# EAGLE design breakoutWithPH (EAGLE 6.5.0)
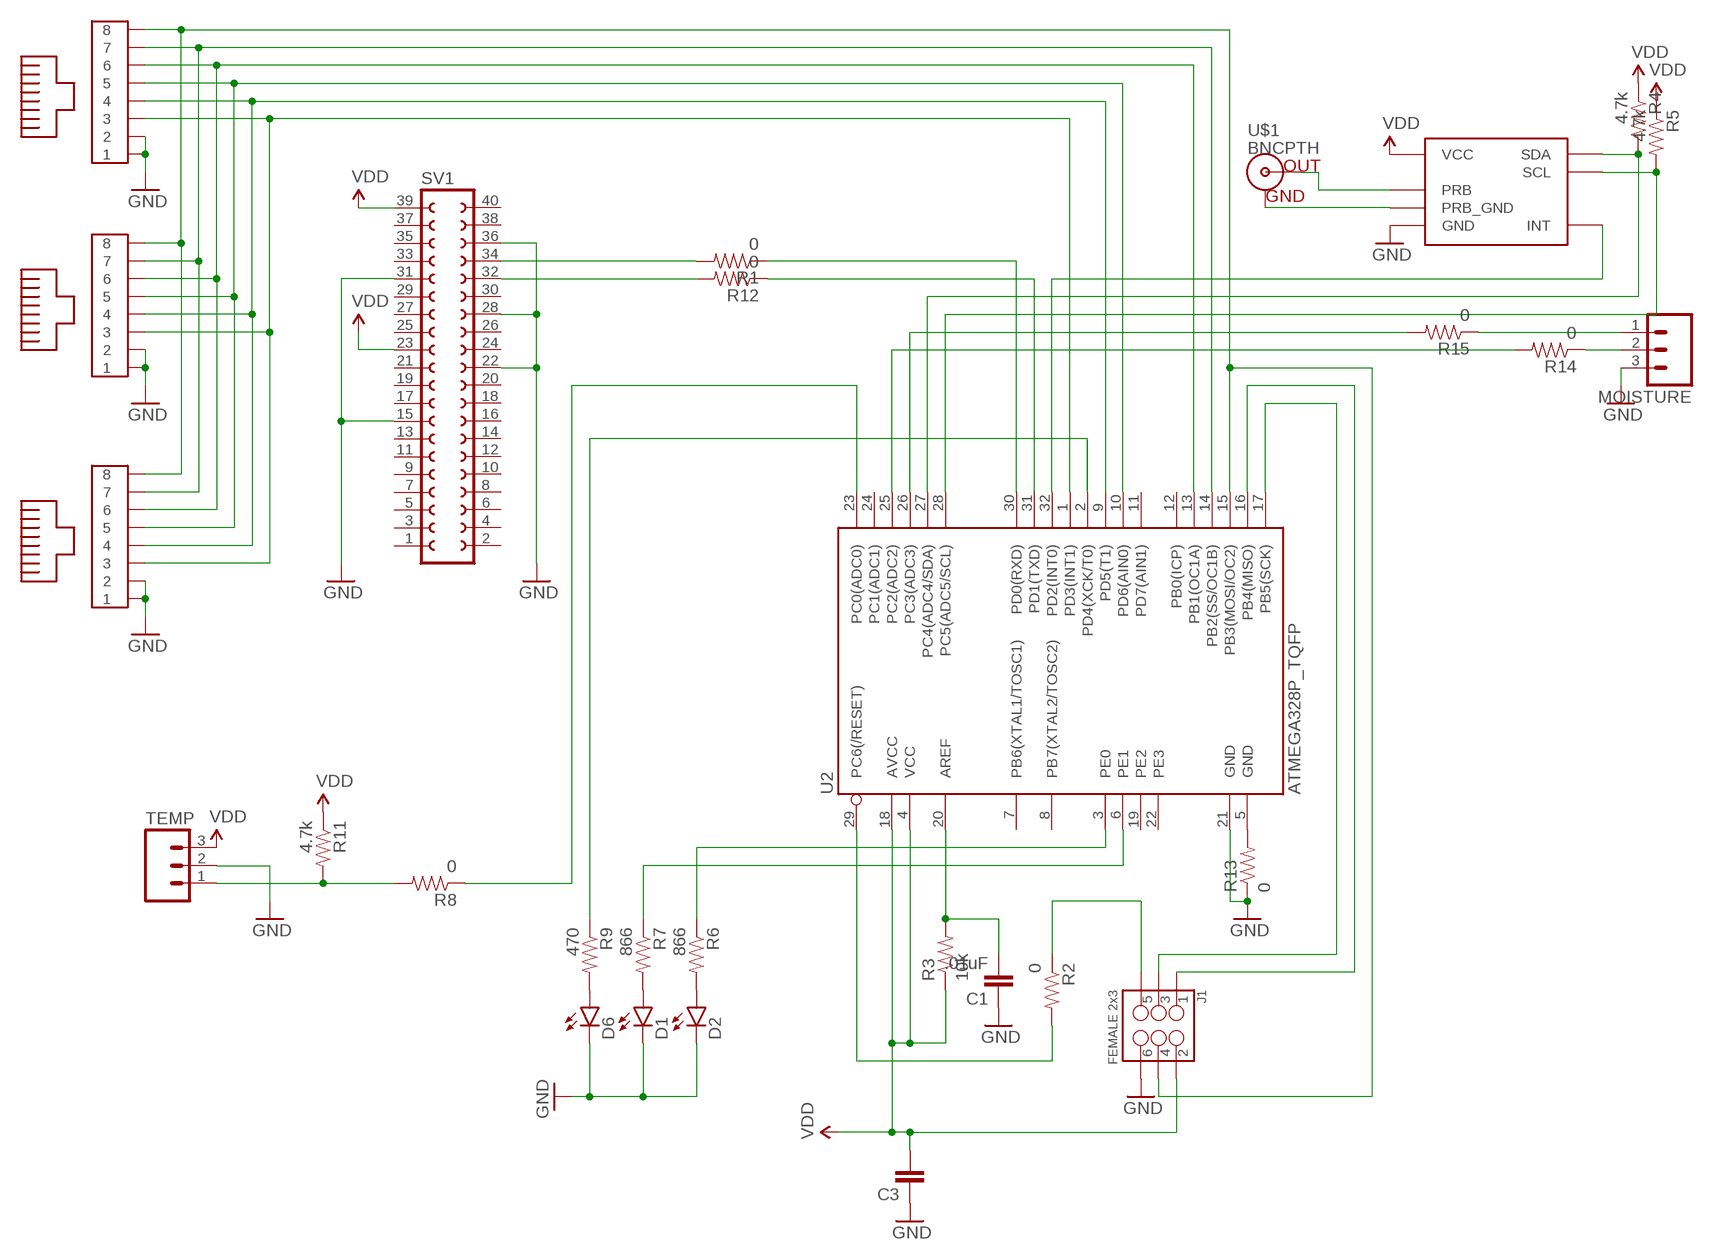
[diagram p0: schematic, sheet 1]

## Parts
C1  .01uF  CAP1206  [1206]
C3  CAP1206  [1206]
D1  LED0603  [LED-0603]
D2  LED0603  [LED-0603]
D6  LED0603  [LED-0603]
J1  FEMALE 2x3  M03X2FEMALE  [2X3]
MOISTURE  M03LOCK_LONGPADS  [1X03_LOCK_LONGPADS]
R1  0  RESISTOR1206  [1206]
R2  0  RESISTOR1206  [1206]
R3  10k  RESISTOR1206  [1206]
R4  4.7k  RESISTOR1206  [1206]
R5  4.7k  RESISTOR1206  [1206]
R6  866  RESISTOR1206  [1206]
R7  866  RESISTOR1206  [1206]
R8  0  RESISTOR1206  [1206]
R9  470  RESISTOR1206  [1206]
R11  4.7k  RESISTOR1206  [1206]
R12  0  RESISTOR1206  [1206]
R13  0  RESISTOR1206  [1206]
R14  0  RESISTOR1206  [1206]
R15  0  RESISTOR1206  [1206]
SV1  FE20-2  [FE20-2]
TEMP  M03LOCK_LONGPADS  [1X03_LOCK_LONGPADS]
U1  PH_SMD  [PH_SMD]
U2  ATMEGA328P_TQFP  [TQFP32-08]
U$1  BNCPTH  [BNC]
U$2  MOLEX-RJ45-SMT  [MOLEX-RJ45-SMT]
U$3  MOLEX-RJ45-SMT  [MOLEX-RJ45-SMT]
U$4  MOLEX-RJ45-SMT  [MOLEX-RJ45-SMT]

## Nets
GND: C1.1 C3.1 D1.C D2.C D6.C J1.6 MOISTURE.3 R13.1 SV1.15 SV1.22 SV1.28 SV1.31 SV1.36 TEMP.2 U1.6(GND) U2.21(GND) U$2.1 U$2.2 U$3.1 U$3.2 U$4.1 U$4.2
N$1: R12.1 U2.31(PD1(TXD))
N$2: J1.5 R2.1
N$3: U2.9(PD5(T1)) U$2.4 U$3.4 U$4.4
N$4: U2.1(PD3(INT1)) U$2.3 U$3.3 U$4.3
N$5: J1.4 U2.15(PB3(MOSI/OC2)) U$2.8 U$3.8 U$4.8
N$6: U2.10(PD6(AIN0)) U$2.5 U$3.5 U$4.5
N$7: D2.A R6.2
N$8: R2.2 U2.29(PC6(/RESET))
N$9: R9.1 U2.2(PD4(XCK/T0))
N$10: R1.1 U2.30(PD0(RXD))
N$11: J1.3 U2.17(PB5(SCK))
N$12: U2.13(PB1(OC1A)) U$2.6 U$3.6 U$4.6
N$13: U2.14(PB2(SS/OC1B)) U$2.7 U$3.7 U$4.7
N$14: J1.1 U2.16(PB4(MISO))
N$15: R6.1 U2.3(PE0)
N$16: U1.7(INT) U2.32(PD2(INT0))
N$17: R7.1 U2.6(PE1)
N$18: D1.A R7.2
N$19: R1.2 SV1.34
N$20: D6.A R9.2
N$21: C1.2 R3.2 U2.20(AREF)
N$23: R8.1 U2.23(PC0(ADC0))
N$24: R8.2 R11.2 TEMP.1
N$25: R5.2 U1.8(SCL) U2.28(PC5(ADC5/SCL))
N$26: R4.2 U1.1(SDA) U2.27(PC4(ADC4/SDA))
N$27: R12.2 SV1.32
N$28: R13.2 U2.5(GND)
N$29: U1.4(PRB) U$1.S(OUT)
N$30: R15.2 U2.26(PC3(ADC3))
N$31: R14.2 U2.25(PC2(ADC2))
N$32: MOISTURE.2 R14.1
N$33: MOISTURE.1 R15.1
PRB_GND: U1.5(PRB_GND) U$1.GND
VDD: C3.2 J1.2 R3.1 R4.1 R5.1 R11.1 SV1.23 SV1.39 TEMP.3 U1.3(VCC) U2.4(VCC) U2.18(AVCC)
Unconnected: SV1.1 SV1.2 SV1.3 SV1.4 SV1.5 SV1.6 SV1.7 SV1.8 SV1.9 SV1.10 SV1.11 SV1.12 SV1.13 SV1.14 SV1.16 SV1.17 SV1.18 SV1.19 SV1.20 SV1.21 SV1.24 SV1.25 SV1.26 SV1.27 SV1.29 SV1.30 SV1.33 SV1.35 SV1.37 SV1.38 SV1.40 U2.7(PB6(XTAL1/TOSC1)) U2.8(PB7(XTAL2/TOSC2)) U2.11(PD7(AIN1)) U2.12(PB0(ICP)) U2.19(PE2) U2.22(PE3) U2.24(PC1(ADC1))

## Library data of the parts
C1 C3 = SparkFun-Capacitors:CAP: Capacitor Standard 0603 ceramic capacitor, and 0.1" leaded capacitor.
D1 D2 D6 = SparkFun-LED:LED: LEDs Standard schematic elements and footprints for 5mm, 3mm, 1206, and 0603 sized LEDs. 5mm - Spark Fun Electronics SKU : COM-00529 (and others)
J1 = SparkFun-Connectors:M03X2: 2x3 .1" header. Shrouded, with keying- CONN-10681 SMT- CONN-11415 Pogo pins- HW-11044; PROD_ID: CONN-11566
MOISTURE TEMP = SparkFun-Connectors:M03: Header 3 Standard 3-pin 0.1" header. Use with straight break away headers (SKU : PRT-00116), right angle break away headers (PRT-00553), swiss pins (PRT-00743), machine pins (PRT-00117), and female headers (PRT-00115). Molex polarized connector foot print use with SKU : PRT-08232 with associated crimp pins and housings.
R1-R9 R11-R15 = SparkFun-Resistors:RESISTOR: Resistor Basic schematic elements and footprints for 0603, 1206, and PTH resistors.
SV1 = con-lsta:FE20-2: FEMALE HEADER; OC_FARNELL: unknown; OC_NEWARK: unknown
U1 = custom-mlane:PH_SMD
U2 = custom-mlane:ATMEGA328P_TQFP; PROD_ID: IC-09069; VALUE: ATMEGA328PB_TQFP
U$1 = SparkFun-Connectors:BNC: BNC Connector, Mouser Part# 5227161
U$2-U$4 = SMD-RJ45:MOLEX-RJ45-SMT

## Board
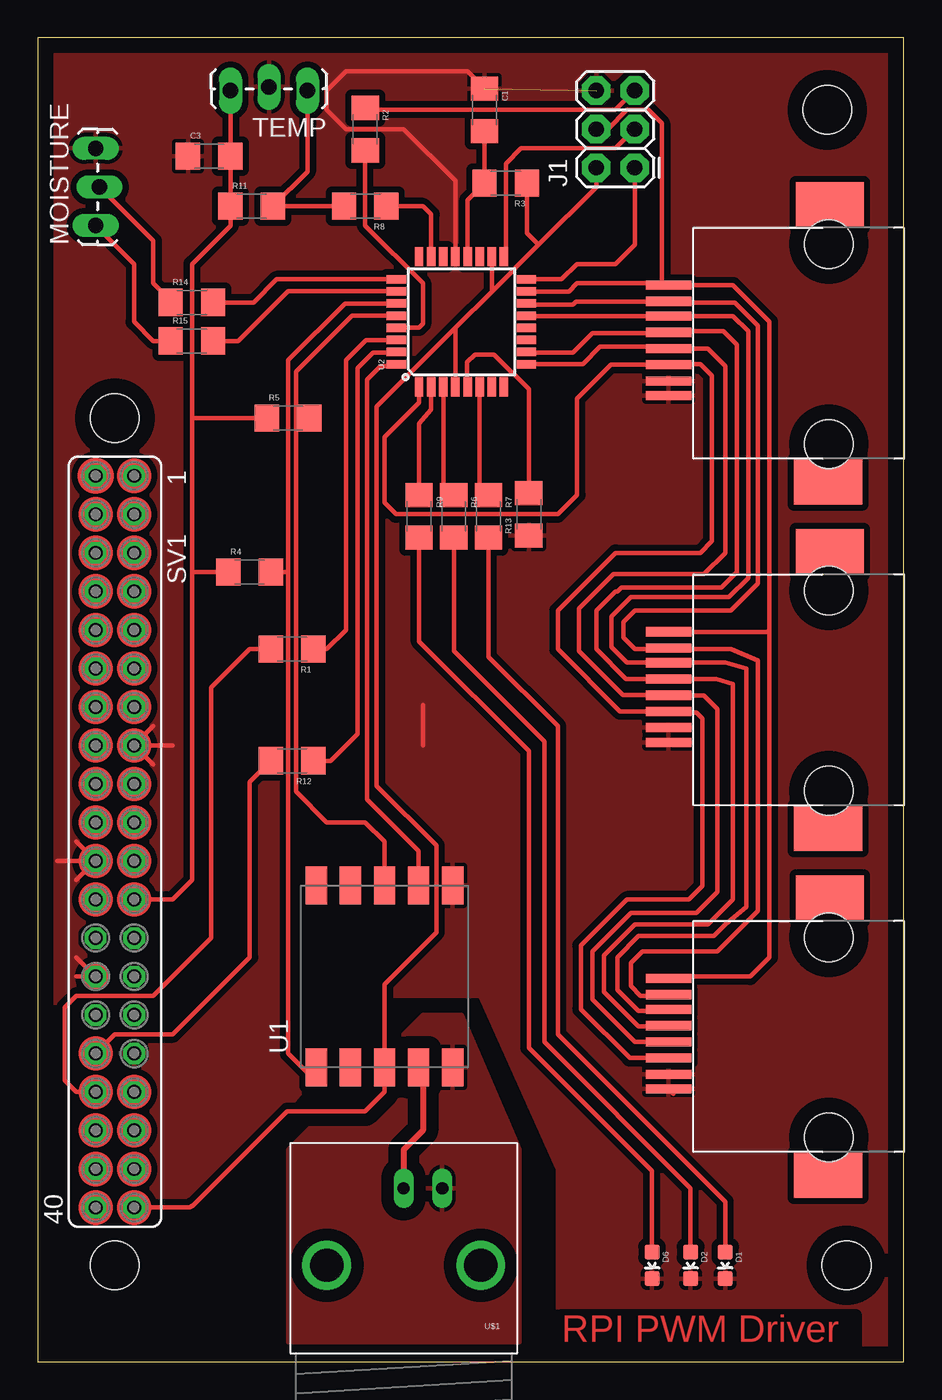
[diagram p1: board, top side]
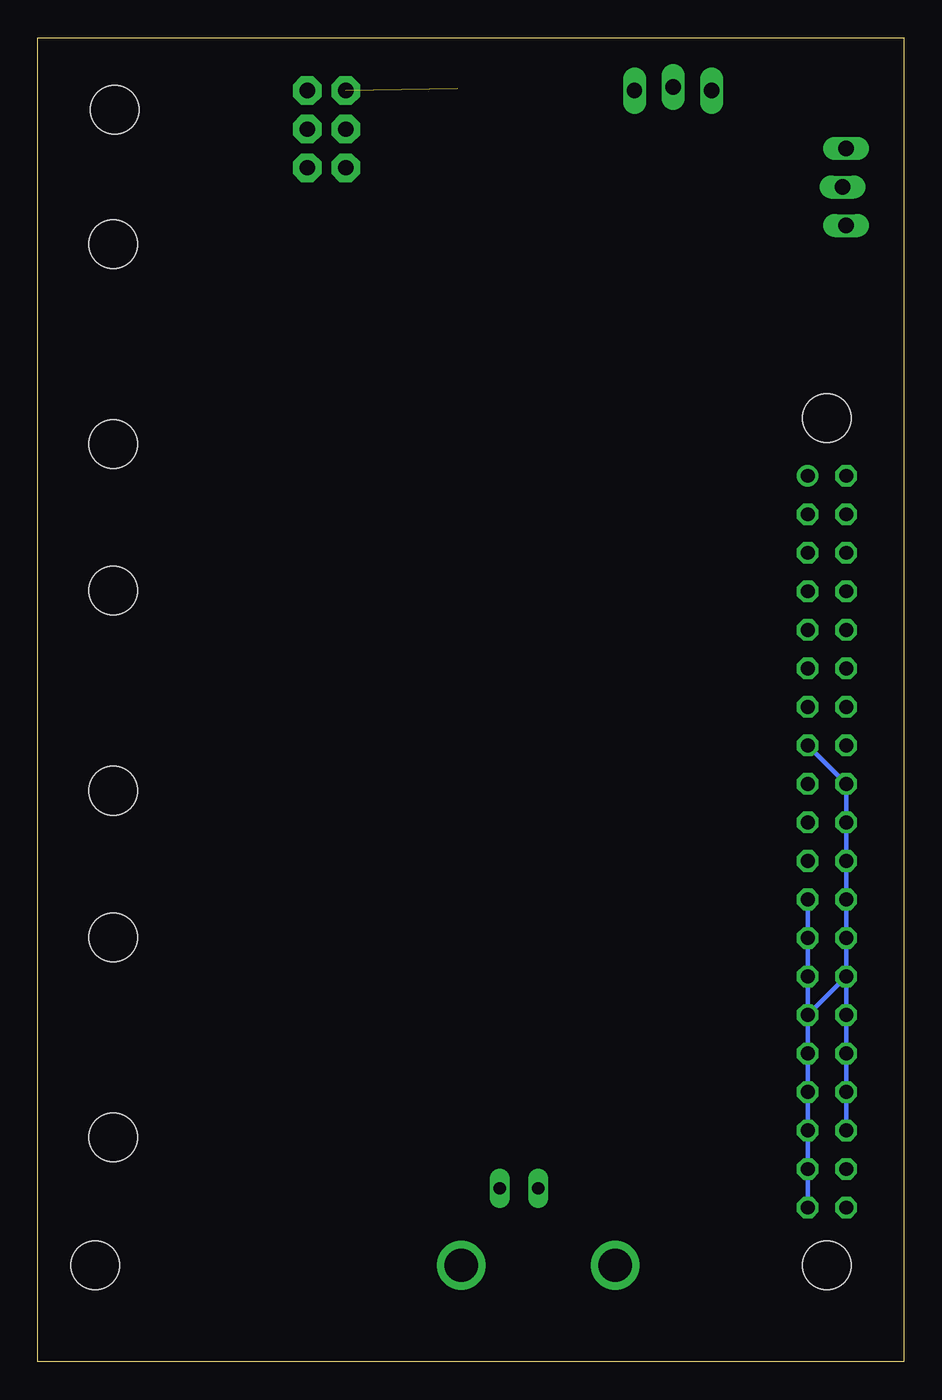
[diagram p2: board, bottom side, seen from below]

Size 57.13 x 87.3 mm. Coordinates in mm from the lower left corner, seen from the top.
Outline: 0,0 57.13,0 57.13,87.3 0,87.3 0,0
Copper layers (1*16): Top 0.035mm / dielectric 1.5mm / Bottom 0.035mm
Design rules "default": minimum track width 10mil, minimum drill 24mil, track to track 8mil, track to pad 8mil, pad to pad 8mil, via to via 8mil, smd to smd 8mil, copper to edge 40mil, drill to drill 8mil, minimum pad ring 10mil, minimum via ring 8mil, stop-mask expansion 4mil, vias tented up to drill 0mil, thermal gap 10mil
Holes 3.2 mm at 52.07,82.55 5.08,6.35 53.34,6.35 5.08,62.23

### Footprints (pad centres in the part's own frame; a part is rotated, then mirrored left to right if it is on the bottom)
1206 = smd 1.6 x 1.8: 1 -1.4,0; 2 1.4,0
LED-0603 = smd 1 x 1: A 0,-0.877; C 0,0.877
2X3 = drill 1.016 pad 1.88 octagon: 1 0,0; 2 0,2.54; 3 2.54,0; 4 2.54,2.54; 5 5.08,0; 6 5.08,2.54
1X03_LOCK_LONGPADS = drill 1.016 long: 1 0,0; 2 2.54,-0.254; 3 5.08,0
FE20-2 = drill 0.914: 1 -24.13,1.27 | drill 0.914 octagon: 2 -24.13,-1.27; 3 -21.59,1.27; 4 -21.59,-1.27; 5 -19.05,1.27; 6 -19.05,-1.27; 7 -16.51,1.27; 8 -16.51,-1.27; 9 -13.97,1.27; 10 -13.97,-1.27; 11 -11.43,1.27; 12 -11.43,-1.27; 13 -8.89,1.27; 14 -8.89,-1.27; 15 -6.35,1.27; 16 -6.35,-1.27; 17 -3.81,1.27; 18 -3.81,-1.27; 19 -1.27,1.27; 20 -1.27,-1.27; 21 1.27,1.27; 22 1.27,-1.27; 23 3.81,1.27; 24 3.81,-1.27; 25 6.35,1.27; 26 6.35,-1.27; 27 8.89,1.27; 28 8.89,-1.27; 29 11.43,1.27; 30 11.43,-1.27; 31 13.97,1.27; 32 13.97,-1.27; 33 16.51,1.27; 34 16.51,-1.27; 35 19.05,1.27; 36 19.05,-1.27; 37 21.59,1.27; 38 21.59,-1.27; 39 24.13,1.27; 40 24.13,-1.27
PH_SMD = smd 2.5 x 1.4: 1 -6,4.5; 2 -6,2.25; 3 -6,0; 4 -6,-2.25; 5 -6,-4.5; 6 6,-4.5; 7 6,-2.25; 8 6,0; 9 6,2.25; 10 6,4.5
TQFP32-08 = smd 1.27 x 0.559: 1 -4.293,2.8; 2 -4.293,2; 3 -4.293,1.2; 4 -4.293,0.4; 5 -4.293,-0.4; 6 -4.293,-1.2; 7 -4.293,-2; 8 -4.293,-2.8; 17 4.293,-2.8; 18 4.293,-2; 19 4.293,-1.2; 20 4.293,-0.4; 21 4.293,0.4; 22 4.293,1.2; 23 4.293,2; 24 4.293,2.8 | smd 0.559 x 1.27: 9 -2.8,-4.293; 10 -2,-4.293; 11 -1.2,-4.293; 12 -0.4,-4.293; 13 0.4,-4.293; 14 1.2,-4.293; 15 2,-4.293; 16 2.8,-4.293; 25 2.8,4.293; 26 2,4.293; 27 1.2,4.293; 28 0.4,4.293; 29 -0.4,4.293; 30 -1.2,4.293; 31 -2,4.293; 32 -2.8,4.293
BNC = drill 2.2: 3 -5.08,5.08; 4 5.08,5.08 | drill 0.8 long: GND -2.54,0; S 0,0
MOLEX-RJ45-SMT = smd 3 x 0.6: 1 10.48,3.61; 2 10.48,2.64; 3 10.48,1.57; 4 10.48,0.5; 5 10.48,-0.57; 6 10.48,-1.64; 7 10.48,-2.61; 8 10.48,-3.68 | smd 4.5 x 3: P$1 -0.16,-8.97; P$2 -0.06,9.28 | hole 3.2: -0.1,6.8; -0.1,-6.4

### Placement (x,y rotation side)
C1  29.46,82.55 270 top
C3  11.3,79.5 0 top
D1  45.34,6.35 180 top
D2  43.05,6.35 180 top
D6  40.51,6.35 180 top
J1  39.37,78.74 90 top
MOISTURE  3.81,74.93 90 top
R1  16.76,46.99 180 top
R2  21.59,81.28 270 top
R3  30.86,77.72 180 top
R4  13.97,52.07 0 top
R5  16.51,62.23 0 top
R6  27.43,55.75 270 top
R7  29.72,55.75 270 top
R8  21.59,76.2 180 top
R9  25.15,55.75 270 top
R11  14.1,76.2 0 top
R12  16.76,39.62 180 top
R13  32.38,55.88 90 top
R14  10.16,69.85 0 top
R15  10.16,67.31 0 top
SV1  5.08,34.29 270 top
TEMP  17.78,83.82 180 top
U1  22.86,25.4 90 top
U2  27.94,68.58 90 top
U$1  24.13,11.43 180 top
U$2  52.07,67.31 180 top
U$3  52.07,21.59 180 top
U$4  52.07,44.45 180 top

### Tracks (layer width: path | path; a pad name or v marks a point on that pad's centre or on a via)
GND  (1 unrouted)
  Top 0.254: 41.91,40.64 U$4.1 41.91,40.64
  Top 0.305: 41.91,17.66 U$3.1 | 25.4,43.32 25.4,40.64 | SV1.15 8.89,40.64 | 2.54,25.4 SV1.28 2.54,26.67 | SV1.22 1.27,33.02 | SV1.22 2.54,31.75 | SV1.22 2.54,34.29 | SV1.15 7.62,41.91 | SV1.15 7.62,39.37 | U2.21 27.54,77.87 24.13,81.28 20.32,81.28 19.05,82.55 19.05,83.82 20.32,85.09 28.32,85.09 C1.1
  Bottom 0.305: SV1.36 SV1.28 | SV1.28 SV1.22 3.81,38.1 SV1.15 | SV1.28 6.35,22.86 SV1.31
  pour Top (isolate 0.406): 57.15,0 34.29,0 34.29,12.7 29.21,24.13 22.86,24.13 21.59,22.86 15.24,15.24 15.24,0 0,0 0,87.63 57.15,87.63
N$1
  Top 0.305: U2.31 23.61,66.55 22.1,66.55 21.08,65.53 21.08,41.4 19.3,39.62 R12.1
N$2
  Top 0.305: J1.5 38.1,82.55 21.72,82.55 R2.1
N$3
  Top 0.305: U2.9 35.94,65.79 37.08,66.93 41.47,66.93 U$2.4 44.2,66.8 45.34,65.66 45.34,53.34 43.94,51.94 37.97,51.94 35.69,49.66 35.69,46.86 38.6,43.95 U$4.4 43.94,43.94 44.83,43.05 44.83,30.99 43.43,29.59 39.12,29.59 36.58,27.05 36.58,23.88 39.37,21.08 U$3.4
N$4
  Top 0.305: U2.1 25.15,63.25 22.86,60.96 22.86,56.64 23.62,55.88 34.29,55.88 35.56,57.15 35.56,63.5 37.8,65.74 U$2.3 41.64,65.79 43.69,65.79 44.45,65.02 44.45,54.1 43.69,53.34 38.1,53.34 34.29,49.53 34.29,46.99 38.4,42.88 U$4.3 41.67,42.8 43.43,42.8 43.82,42.42 43.82,31.37 42.93,30.48 38.86,30.48 35.81,27.43 35.81,23.24 39.04,20.02 U$3.3
N$5
  Top 0.305: 48.26,48.26 48.26,68.58 45.85,70.99 U$2.8 41.46,71.12 41.02,71.12 | 48.26,48.26 48.26,26.67 46.99,25.4 41.72,25.4 U$3.8 | U$4.8 48.13,48.13 48.26,48.26 | U2.15 35.02,70.58 35.56,71.12 41.02,71.12 | J1.4 37.59,81.28 38.86,82.55 40.26,82.55 41.15,81.66 41.15,71.25 41.02,71.12
N$6
  Top 0.305: U$3.5 41.4,21.97 41.27,22.1 39.62,22.1 37.34,24.38 37.34,26.8 39.37,28.83 44.2,28.83 45.85,30.48 45.85,44.7 44.77,45.02 U$4.5 38.8,45.02 36.83,46.99 36.83,49.53 38.1,50.8 38.23,50.8 38.48,51.05 45.09,51.05 46.1,52.07 46.1,67.06 45.21,67.95 41.66,67.95 U$2.5 41.53,67.82 36.58,67.82 35.31,66.55 32.27,66.55 U2.10
N$7
  Top 0.305: R6.2 27.43,46.86 33.4,40.89 33.4,21.08 43.05,11.43 D2.A
N$8
  Top 0.305: U2.29 23.67,68.2 25.15,68.2 25.4,68.45 25.4,71.12 21.59,74.93 R2.2
N$9
  Top 0.305: U2.2 25.94,62.77 25.15,61.85 R9.1
N$10
  Top 0.305: U2.30 21.66,67.38 20.32,66.04 20.32,48.26 19.05,46.99 R1.1
N$11
  Top 0.305: J1.3 38.1,80.01 31.88,80.01 30.86,78.99 30.86,72.99 U2.17
N$12
  Top 0.305: 41.45,46.23 U$4.6 | U$4.6 45.35,46.09 46.74,45.72 46.74,29.97 45.34,28.83 44.58,28.07 39.62,28.07 38.23,26.67 38.23,24.51 39.62,23.11 41.2,23.11 41.45,23.37 U$3.6 | U$4.6 41.58,46.1 38.86,46.1 37.85,47.12 37.85,49.15 39.12,50.42 45.59,50.42 46.86,51.69 46.86,67.95 45.86,68.95 U$2.6 41.58,68.96 32.25,68.96 U2.13
N$13
  Top 0.254: 43.18,69.85 41.91,69.85 U$2.7 | 43.18,46.99 41.91,46.99 U$4.7
  Top 0.305: 41.91,69.85 45.97,69.85 47.5,68.33 47.5,51.31 45.72,49.53 39.37,49.53 38.61,48.77 38.61,47.75 39.37,46.99 41.52,46.99 U$4.7 41.66,46.99 45.72,46.99 47.5,46.23 47.5,29.72 44.83,27.05 39.88,27.05 39.12,26.29 39.12,24.77 39.75,24.13 41.52,24.13 U$3.7 | U$2.7 35.5,69.92 35.31,69.72 32.29,69.72 U2.14
N$14
  Top 0.305: U2.16 34.55,71.38 35.56,72.39 38.1,72.39 39.37,73.66 J1.1
N$15
  Top 0.305: U2.3 26.74,57.84 R6.1
N$16
  Top 0.305: U2.32 23.53,65.66 22.61,65.66 21.72,64.77 21.72,37.08 25.11,33.69 U1.7
N$17
  Top 0.305: U2.6 29.14,57.73 R7.1
N$18
  Top 0.305: R7.2 29.72,46.48 34.29,41.91 34.29,21.59 45.34,10.54 D1.A
N$19
  Top 0.305: SV1.34 2.54,17.78 1.78,18.54 1.78,23.37 2.54,24.13 7.62,24.13 11.43,27.94 11.43,44.45 13.97,46.99 R1.2
N$20
  Top 0.305: R9.2 25.15,47.5 32.38,40.26 32.38,20.7 40.51,12.57 D6.A
N$21
  Top 0.305: U2.20 28.34,76.6 R3.2 C1.2
N$23
  Top 0.305: U2.23 25.94,75.66 25.4,76.2 R8.1
N$24
  Top 0.305: TEMP.1 17.78,78.48 R11.2 R8.2
N$25
  Top 0.305: U2.28 20.72,68.98 17.02,65.28 17.02,62.23 | 17.02,62.23 17.02,37.59 19.05,35.56 21.59,35.56 22.86,34.29 U1.8 | R5.2 17.02,62.23
N$26
  Top 0.305: U2.27 20.25,69.78 16.51,66.04 16.51,52.07 | 16.51,52.07 16.51,20.32 17.78,19.05 18.01,19.05 U1.1 | R4.2 16.51,52.07
N$27
  Top 0.305: SV1.32 5.08,21.59 8.89,21.59 13.97,26.67 13.97,38.23 R12.2
N$28
  Top 0.305: U2.5 28.32,64.31 28.32,65.91 28.83,66.42 30.1,66.42 32.38,64.14 R13.2
N$29
  Top 0.406: U1.4 25.4,19.11 25.4,15.24 24.13,13.97 U$1.S
N$30
  Top 0.305: U2.26 23.61,70.61 16.51,70.61 13.21,67.31 R15.2
N$31
  Top 0.305: U2.25 15.75,71.37 14.22,69.85 R14.2
N$32
  Top 0.305: R14.1 8.76,69.98 7.62,71.12 7.62,73.91 MOISTURE.2
N$33
  Top 0.305: MOISTURE.1 6.35,72.39 6.35,68.58 7.62,67.31 R15.1
PRB_GND
  pour Top (isolate 0.813): 31.75,1.27 16.51,1.27 16.51,13.97 25.4,22.86 27.94,22.86 31.75,13.97
VDD
  Top 0.305: SV1.23 8.89,30.48 10.16,31.75 10.16,52.07 | 10.16,10.29 10.09,10.22 | 10.09,10.22 10.03,10.16 SV1.39 | 10.09,10.22 10.16,10.22 16.45,16.51 21.59,16.51 22.86,17.78 U1.3 22.86,24.89 26.29,28.32 26.29,34.04 22.35,37.97 22.35,62.99 27.54,68.18 | U2.4 27.54,68.18 | 10.16,52.07 10.16,62.23 | 10.16,62.23 10.16,72.39 12.7,74.93 R11.1 C3.2 TEMP.3 | J1.2 36.83,77.47 33.02,73.66 | 33.02,73.66 29.94,70.58 | 29.94,70.58 27.54,68.18 | U2.18 29.94,70.58 | R3.1 32.26,74.42 33.02,73.66 | R4.1 10.16,52.07 | R5.1 10.16,62.23
  Bottom 0.305: SV1.23 SV1.39
(copper drawn outside any net)
  shapes: Top area x10, Top circle x36

### Text on the board
Top: RPI PWM Driver